# EAGLE design Adafruit NeoPixel Ring 24 B - Holder 2 (EAGLE 9.5.2)
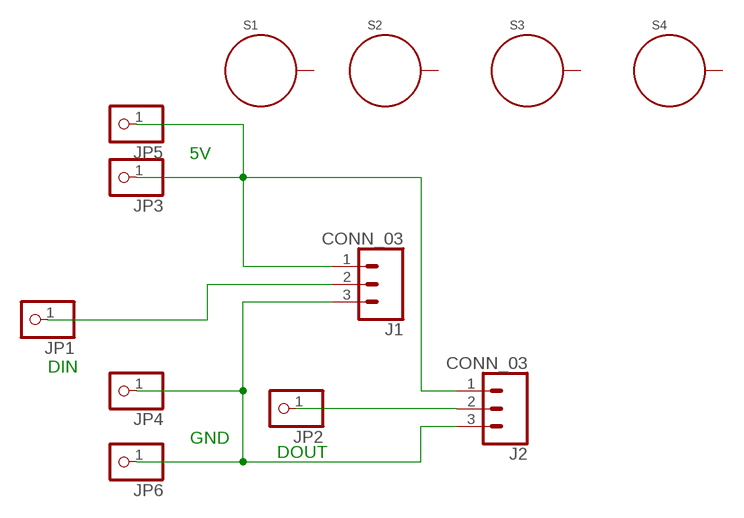
[diagram p0: schematic, sheet 1]

## Parts
J1  CONN_03  [1X03_3.5MM_RA]
J2  CONN_03  [1X03_3.5MM_RA]
JP1  PINHD-1X1CB  [1X01-CLEANBIG]
JP2  PINHD-1X1CB  [1X01-CLEANBIG]
JP3  PINHD-1X1CB  [1X01-CLEANBIG]
JP4  PINHD-1X1CB  [1X01-CLEANBIG]
JP5  PINHD-1X1CB  [1X01-CLEANBIG]
JP6  PINHD-1X1CB  [1X01-CLEANBIG]
S1  STANDOFF_ELECTRICAL.17"  [STANDOFF-ELECTRICAL]
S2  STANDOFF_ELECTRICAL.17"  [STANDOFF-ELECTRICAL]
S3  STANDOFF_ELECTRICAL.17"  [STANDOFF-ELECTRICAL]
S4  STANDOFF_ELECTRICAL.17"  [STANDOFF-ELECTRICAL]

## Nets
N$1: J1.1 J2.1 JP3.1 JP5.1
N$2: J1.3 J2.3 JP4.1 JP6.1
N$3: J1.2 JP1.1
N$24: J2.2 JP2.1
Unconnected: S1.P1 S2.P1 S3.P1 S4.P1

## Notes on the sheet
- 5V
- DIN
- GND
- DOUT

## Library data of the parts
J1 J2 = th_libraries:CONN_03
JP1-JP6 = NeoPixelRing:PINHD-1X1: Pin header 1x1 for 0.1" spacing With round pins
S1-S4 = th_libraries:STANDOFF_ELECTRICAL: A standoff intended to be an electrically connected point. Pad size and stop size allow for a #8 Phillips pan screw head to make a solid connection to the board. Added 144mill drill hole that fits my normal wood screw

## Board
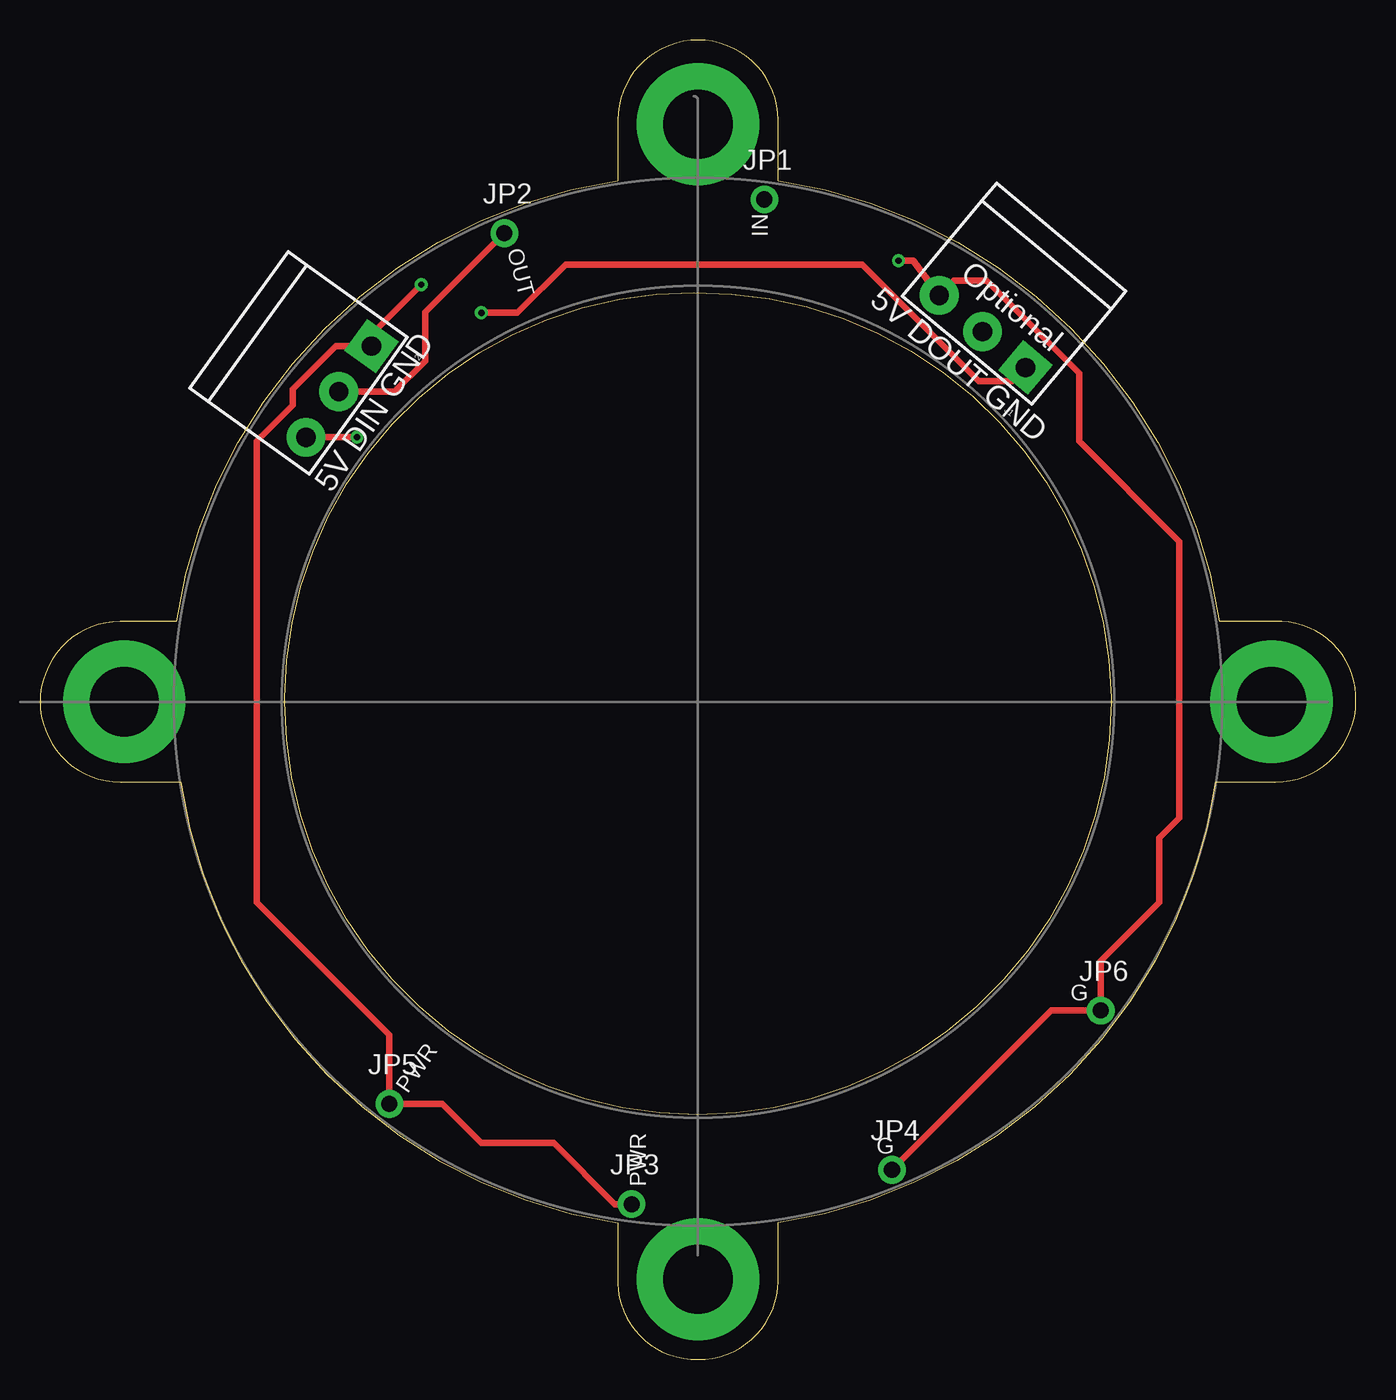
[diagram p1: board, top side]
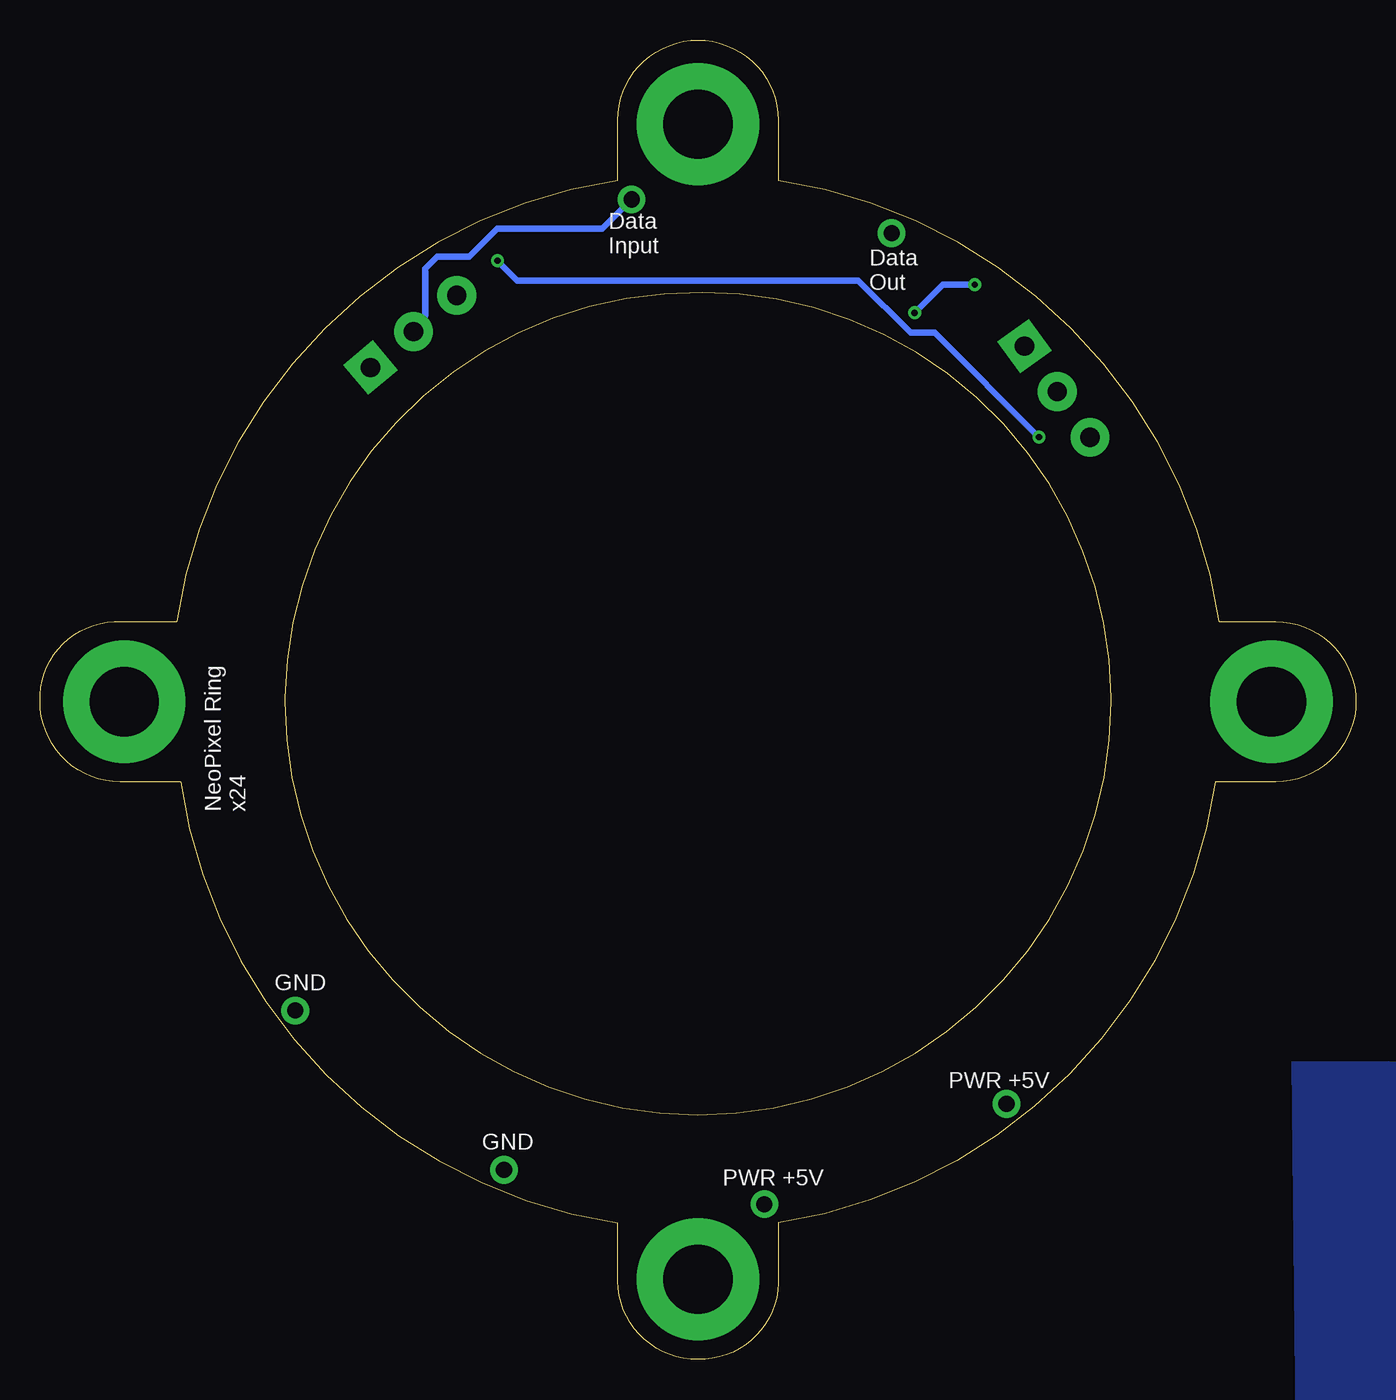
[diagram p2: board, bottom side, seen from below]

Size 82 x 82.25 mm. Coordinates in mm from the lower left corner, seen from the top.
Outline: 40.75,66.5 arc-90 66.75,41.25 66.75,41 arc-90 41,15.25 arc-90 15.25,41 15.25,41.25 arc-90 40.75,66.5
Outline: 8.5,46 5,46 arc90 0,41 arc90 5,36 8.75,36 arc73 36,8.5 36,4.75 arc90 41,0 arc90 46,4.88 46,8.5 arc73 73.25,36 77,36 arc90 82,41 arc90 77.38,46 73.5,46 arc73 46,73.5 46,77.25 arc90 41,82.25 arc90 36,77.25 36,73.5 arc73 8.5,46
Copper layers (1*16): Top 0.035mm / dielectric 1.5mm / Bottom 0.035mm
Design rules "adafruit": minimum track width 8mil, minimum drill 15.5mil, track to track 8mil, track to pad 8mil, pad to pad 8mil, via to via 8mil, smd to smd 8mil, copper to edge 10mil, drill to drill 8mil, minimum pad ring 10mil, minimum via ring 8mil, stop-mask expansion 4mil, vias tented up to drill 20mil, thermal gap 10mil

### Footprints (pad centres in the part's own frame; a part is rotated, then mirrored left to right if it is on the bottom)
1X03_3.5MM_RA = drill 1.2 pad 2.413 square: 1 -0.228,0.023 | drill 1.2 pad 2.413: 2 3.272,0.023; 3 6.772,0.023
1X01-CLEANBIG = drill 1 pad 1.727: 1 0,0
STANDOFF-ELECTRICAL = drill 4.318 pad 7.62: P1 0,0

### Placement (x,y rotation side)
J1  61.25,62 140.1 top
J2  20.5,63 234.3 top
JP1  45.14,72.32 0 top
JP2  28.94,70.21 0 top
JP3  36.86,9.68 0 top
JP4  53.09,11.82 0 top
JP5  21.77,15.93 0 top
JP6  66.1,21.75 0 top
S1  5.25,41 0 top
S2  41,5 0 top
S3  76.75,41 0 top
S4  41,77 0 top

### Tracks (layer width: path | path; a pad name or v marks a point on that pad's centre or on a via)
GND
  pour Top (rank 2): 8.88,-4.2 8.96,-11.96 76.69,-12.48 76.6,-4.72
N$1  (via drill 0.39)
  Top 0.406: v23.75,67 20.65,63.9 J2.1 18.42,63.17 15.75,60.5 15.75,59.5 13.5,57.25 13.5,28.5 21.77,20.23 JP5.1 25.07,15.93 27.5,13.5 32,13.5 35.82,9.68 JP3.1 | v27.5,65.25 29.75,65.25 32.75,68.25 51.25,68.25 58.5,61 60.57,61 J1.1
  Bottom 0.406: v23.75,67 25.75,67 v27.5,65.25
N$2  (via drill 0.39)
  Top 0.406: J2.3 19.74,57.49 v19.75,57.5 | v53.5,68.5 54.42,68.5 J1.3 56.93,67.25 59,67.25 64.75,61.5 64.75,57.25 70.88,51.12 71,51 71,33.75 69.75,32.5 69.75,28.5 66.09,24.84 JP6.1 63.02,21.75 JP4.1
  Bottom 0.406: v19.75,57.5 26.25,64 27.75,64 31,67.25 52.25,67.25 v53.5,68.5
N$3
  Bottom 0.406: J1.2 58,65.07 58,68 57.25,68.75 55.25,68.75 53.5,70.5 46.96,70.5 JP1.1
N$24
  Top 0.406: JP2.1 24,65.28 24,62.25 22.08,60.33 J2.2
VDD
  pour Bottom: -8.07,18.46 -8.36,-6.9 3.59,-6.85 3.87,18.51

### Text on the board
tPlace: IN | OUT | Optional | 5V DOUT GND | 5V DIN GND | G | PWR | G | PWR
bPlace: Data / Input | Data / Out | NeoPixel Ring / x24 | GND | PWR +5V | GND | PWR +5V